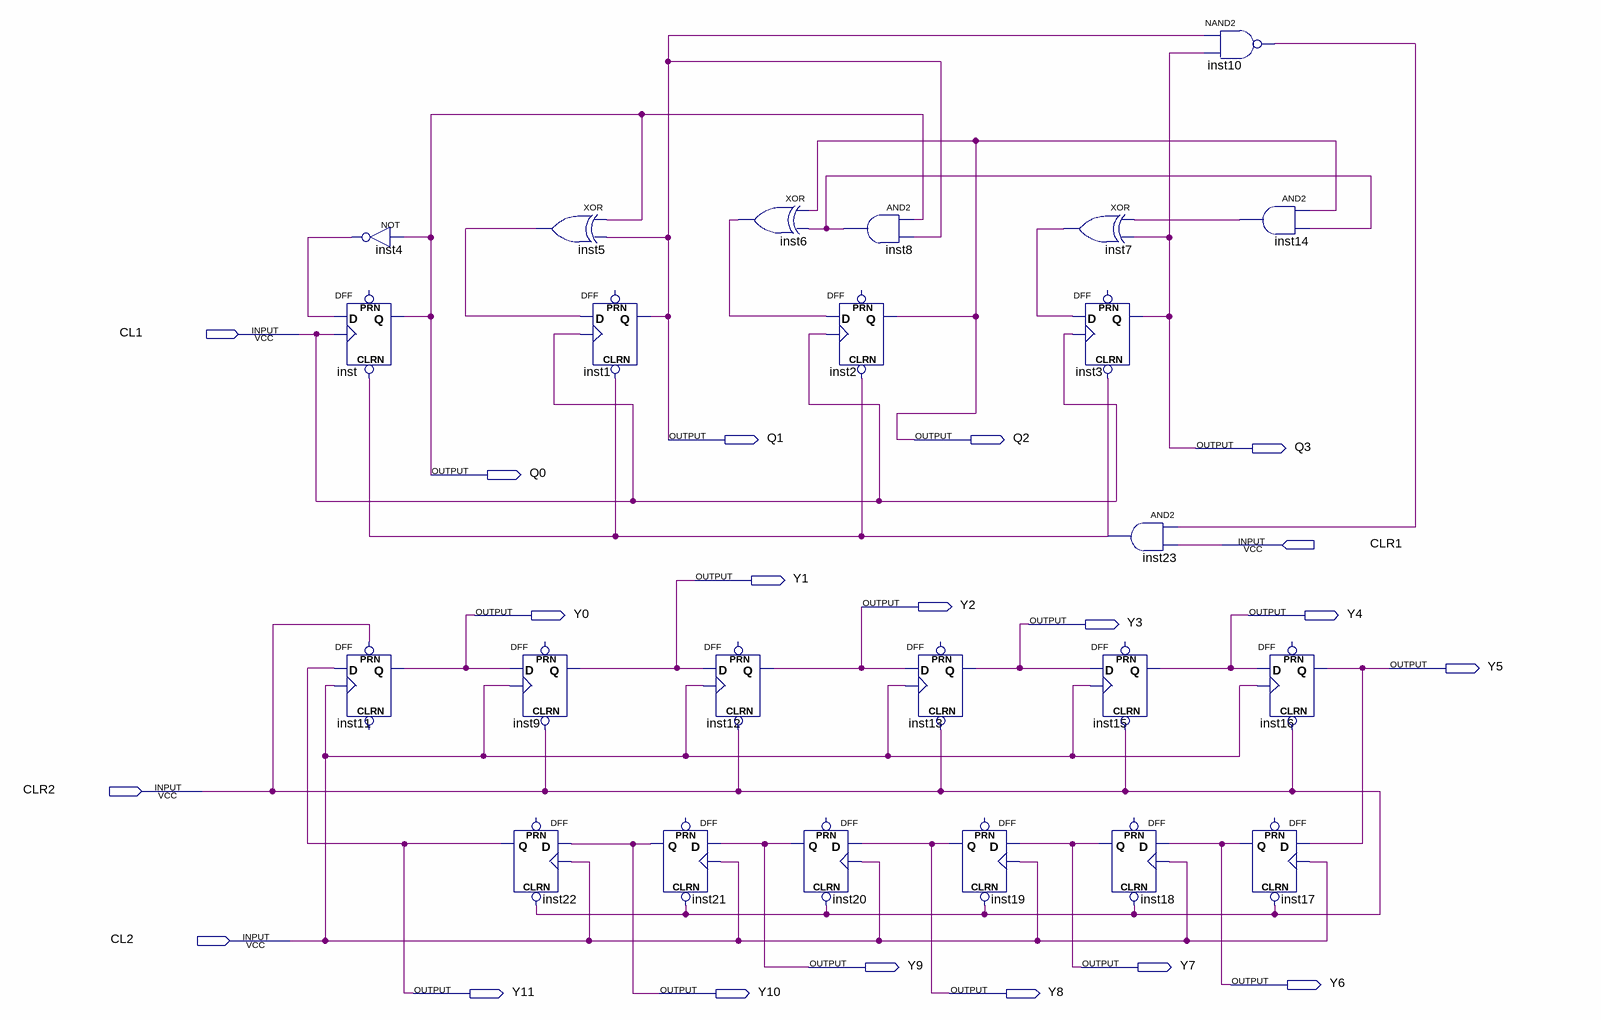
[diagram p0: schematic sheet]
// Quartus schematic sync4.bdf as structural Verilog: 24 symbols, 20 pins
module sync4 (
  input  CL1,
  input  CLR1,
  input  CLR2,
  input  CL2,
  output Q1,
  output Q2,
  output Q3,
  output Q0,
  output Y1,
  output Y2,
  output Y0,
  output Y4,
  output Y3,
  output Y5,
  output Y9,
  output Y7,
  output Y6,
  output Y11,
  output Y10,
  output Y8
);

  wire inst4_out, inst5_out, inst6_out, inst7_out, inst8_out, inst10_out, inst14_out, inst23_out;

  not inst4 (inst4_out, Q0);
  DFF inst (.CLRN(inst23_out), .CLK(CL1), .D(inst4_out), .Q(Q0));  // open: PRN
  DFF inst11 (.CLK(CL2), .D(Y11), .PRN(CLR2), .Q(Y0));  // open: CLRN
  DFF inst9 (.CLRN(CLR2), .CLK(CL2), .D(Y0), .Q(Y1));  // open: PRN
  DFF inst22 (.CLRN(CLR2), .CLK(CL2), .D(Y10), .Q(Y11));  // open: PRN
  xor inst5 (inst5_out, Q0, Q1);
  DFF inst1 (.CLRN(inst23_out), .CLK(CL1), .D(inst5_out), .Q(Q1));  // open: PRN
  DFF inst21 (.CLRN(CLR2), .CLK(CL2), .D(Y9), .Q(Y10));  // open: PRN
  DFF inst12 (.CLRN(CLR2), .CLK(CL2), .D(Y1), .Q(Y2));  // open: PRN
  xor inst6 (inst6_out, Q2, inst8_out);
  DFF inst20 (.CLRN(CLR2), .CLK(CL2), .D(Y8), .Q(Y9));  // open: PRN
  and inst8 (inst8_out, Q0, Q1);
  DFF inst2 (.CLRN(inst23_out), .CLK(CL1), .D(inst6_out), .Q(Q2));  // open: PRN
  DFF inst13 (.CLRN(CLR2), .CLK(CL2), .D(Y2), .Q(Y3));  // open: PRN
  DFF inst19 (.CLRN(CLR2), .CLK(CL2), .D(Y7), .Q(Y8));  // open: PRN
  xor inst7 (inst7_out, inst14_out, Q3);
  DFF inst3 (.CLRN(inst23_out), .CLK(CL1), .D(inst7_out), .Q(Q3));  // open: PRN
  and inst23 (inst23_out, inst10_out, CLR1);
  DFF inst15 (.CLRN(CLR2), .CLK(CL2), .D(Y3), .Q(Y4));  // open: PRN
  DFF inst18 (.CLRN(CLR2), .CLK(CL2), .D(Y6), .Q(Y7));  // open: PRN
  nand inst10 (inst10_out, Q1, Q3);
  and inst14 (inst14_out, Q2, inst8_out);
  DFF inst16 (.CLRN(CLR2), .CLK(CL2), .D(Y4), .Q(Y5));  // open: PRN
  DFF inst17 (.CLRN(CLR2), .CLK(CL2), .D(Y5), .Q(Y6));  // open: PRN
endmodule
